# EAGLE design Button Board (EAGLE 7.2.0)
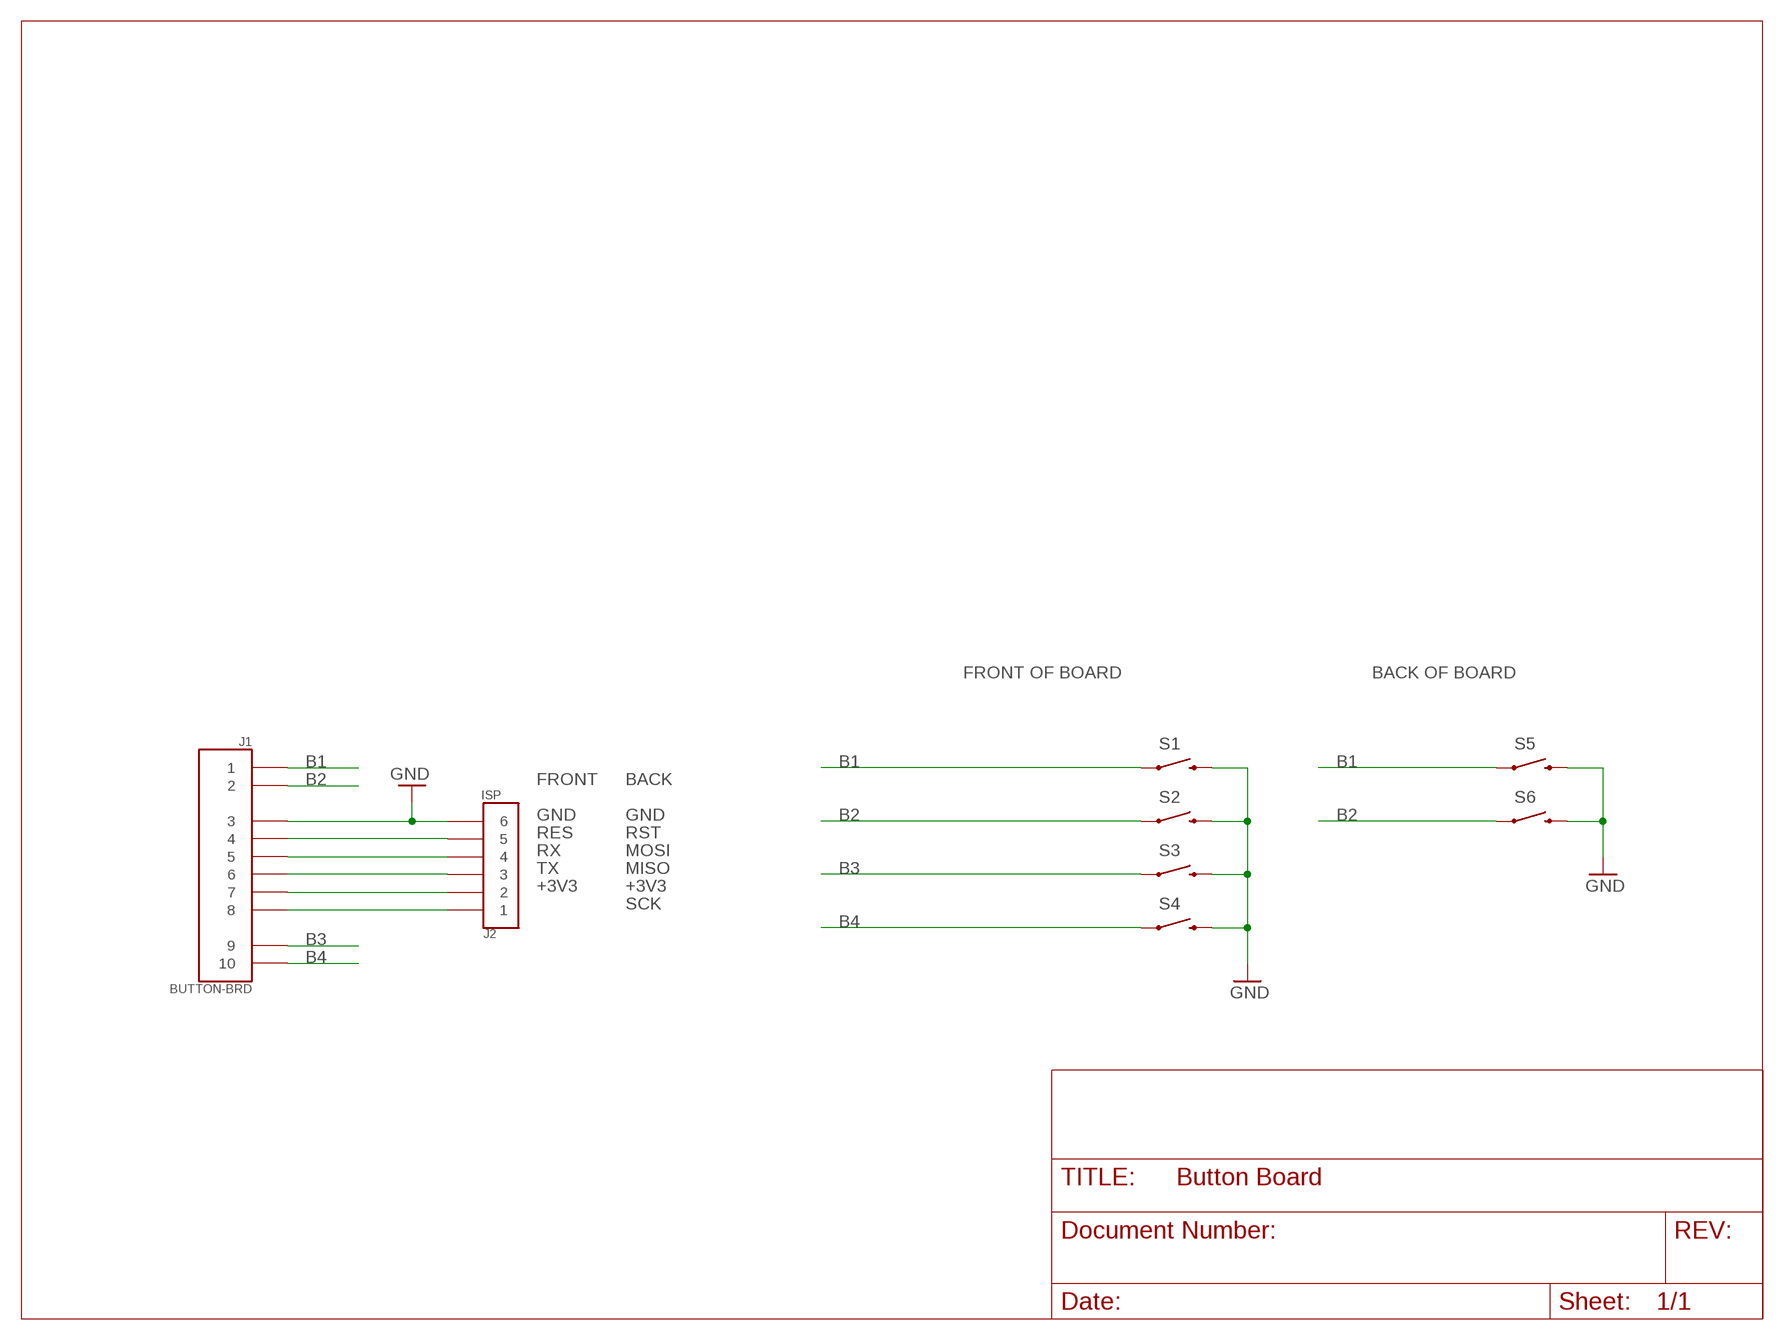
[diagram p0: schematic, sheet 1]

## Parts
J1  BUTTON-BRD  [BUTTON-BRD]
J2  ISP  [ISP]
S1  TACT-SMD  [TACT-SMD]
S2  TACT-SMD  [TACT-SMD]
S3  TACT-SMD  [TACT-SMD]
S4  TACT-SMD  [TACT-SMD]
S5  TACT-SMD  [TACT-SMD]
S6  TACT-SMD  [TACT-SMD]

## Nets
B1: J1.1 S1.P$1 S5.P$1
B2: J1.2 S2.P$1 S6.P$1
B3: J1.9 S3.P$1
B4: J1.10 S4.P$1
GND: J1.3 J2.P$6 S1.P$3 S2.P$3 S3.P$3 S4.P$3 S5.P$3 S6.P$3
N$1: J1.4 J2.P$5
N$2: J1.7 J2.P$2
N$3: J1.5 J2.P$4
N$4: J1.6 J2.P$3
N$6: J1.8 J2.P$1

## Notes on the sheet
- FRONT OF BOARD | BACK OF BOARD
- FRONT | BACK
- GND | GND
- RES | RST
- RX | MOSI
- TX | MISO
- +3V3 | +3V3
- SCK

## Library data of the parts
J1 = OpenWestButtonBoard:BUTTON-BRD
J2 = OpenWestButtonBoard:ISP
S1-S6 = TactSwitch:TACT-SMD: C&K Components PTS645 Series PTS645SM43SMTR92 LFS http://www.digikey.com/product-detail/en/PTS645SM43SMTR92%20LFS/CKN9112TR-ND/1146840

## Board
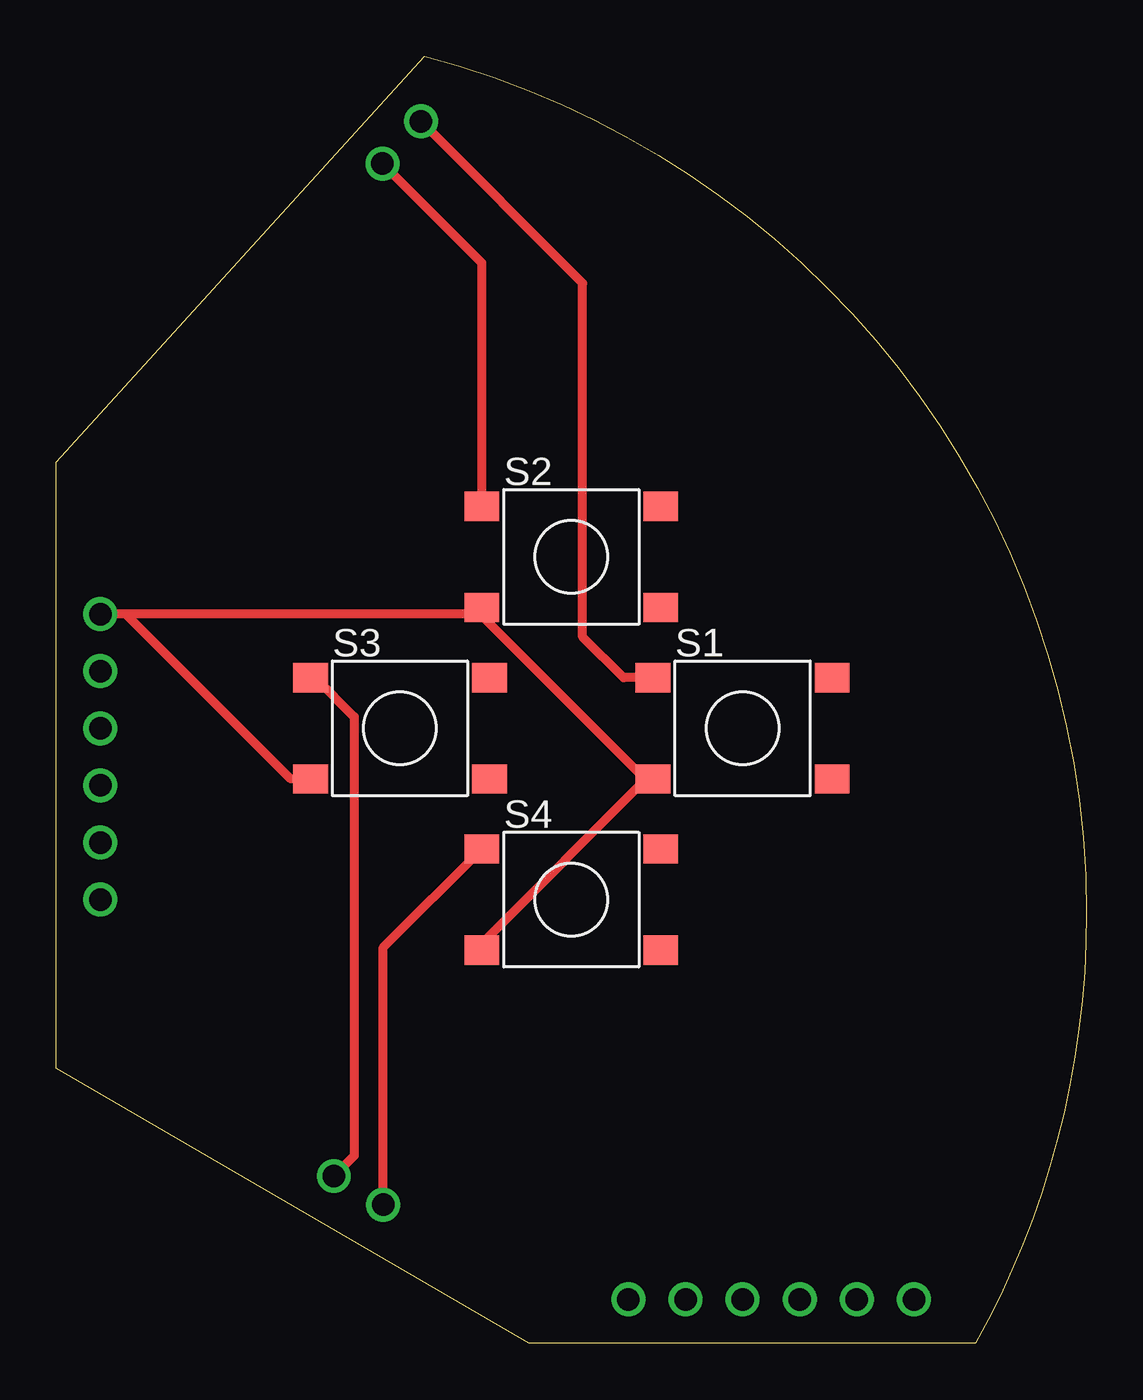
[diagram p1: board, top side]
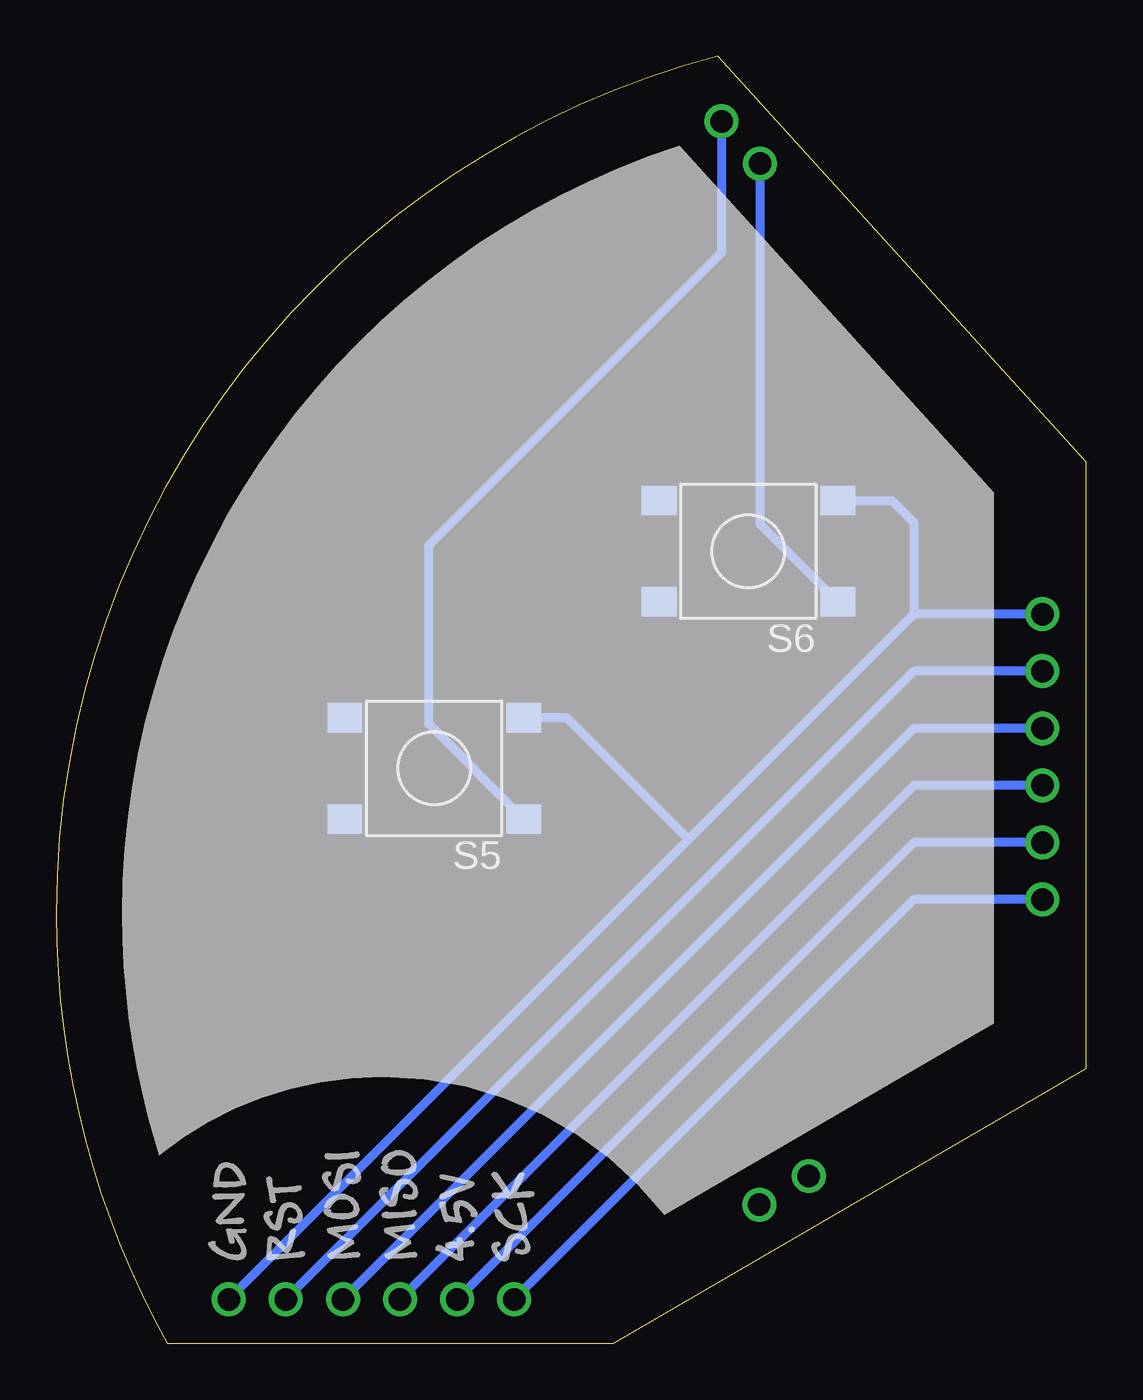
[diagram p2: board, bottom side, seen from below]

Size 45.83 x 57.25 mm. Coordinates in mm from the lower left corner, seen from the top.
Outline: 16.39,57.25 17.96,56.8 19.51,56.29 21.03,55.72 22.52,55.09 23.97,54.4 25.39,53.66 26.78,52.86 28.13,52 29.45,51.09 30.72,50.13 31.95,49.12 33.15,48.07 34.29,46.96 35.4,45.82 36.45,44.62 37.46,43.39 38.42,42.11 39.32,40.8 40.18,39.45 40.98,38.06 41.72,36.64 42.41,35.18 43.04,33.69 43.61,32.17 44.12,30.62 44.56,29.05 44.94,27.45 45.26,25.82 45.5,24.17 45.68,22.5 45.79,20.81 45.83,19.1 45.8,17.81 45.74,16.52 45.64,15.25 45.5,13.99 45.31,12.74 45.09,11.51 44.83,10.28 44.54,9.07 44.21,7.88 43.84,6.7 43.43,5.54 42.99,4.4 42.52,3.27 42.01,2.16 41.47,1.07 40.9,0 21.03,0 0,12.22 0,39.19 16.39,57.25
Copper layers (1*16): Top 0.035mm / dielectric 1.5mm / Bottom 0.035mm
Design rules "default": minimum track width 10mil, minimum drill 24mil, track to track 8mil, track to pad 8mil, pad to pad 8mil, via to via 8mil, smd to smd 8mil, copper to edge 40mil, drill to drill 8mil, minimum pad ring 10mil, minimum via ring 8mil, stop-mask expansion 4mil, vias tented up to drill 0mil, thermal gap 10mil

### Footprints (pad centres in the part's own frame; a part is rotated, then mirrored left to right if it is on the bottom)
BUTTON-BRD = drill 1: 1 -6.686,25.725; 2 -8.396,23.846; 3 -20.955,3.81; 4 -20.955,1.27; 5 -20.955,-1.27; 6 -20.955,-3.81; 7 -20.955,-6.35; 8 -20.955,-8.89; 9 -10.564,-21.188; 10 -8.367,-22.462
ISP = drill 1: P$1 -6.35,0; P$2 -3.81,0; P$3 -1.27,0; P$4 1.27,0; P$5 3.81,0; P$6 6.35,0
TACT-SMD = smd 1.55 x 1.3: P$1 -3.98,2.25; P$2 3.98,2.25; P$3 -3.98,-2.25; P$4 3.98,-2.25

### Placement (x,y rotation side)
J1  22.91,28.62 0 top
J2  31.8,1.95 0 top
S1  30.53,27.35 0 top
S2  22.91,34.97 0 top
S3  15.29,27.35 0 top
S4  22.91,19.73 0 top
S5  29.01,25.58 180 bottom
S6  15.04,35.23 180 bottom

### Tracks (layer width: path | path; a pad name or v marks a point on that pad's centre or on a via)
B1
  Top 0.406: S1.P$1 25.23,29.6 23.42,31.42 23.42,47.15 J1.1
  Bottom 0.406: J1.1 16.23,48.52 29.26,35.48 29.26,27.56 S5.P$1
B2
  Top 0.406: S2.P$1 18.93,48.05 J1.2
  Bottom 0.406: J1.2 14.52,36.44 S6.P$1
B3
  Top 0.406: S3.P$1 11.52,29.6 13.26,27.86 13.26,8.35 J1.9
B4
  Top 0.406: J1.10 14.55,17.6 S4.P$1
GND
  Top 0.406: S4.P$3 18.93,17.79 26.21,25.07 | 26.21,25.07 26.77,25.07 S1.P$3 | S2.P$3 18.93,32.35 | 18.93,32.35 18.85,32.43 3.1,32.43 | 26.21,25.07 18.93,32.35 | 3.1,32.43 J1.3 | S3.P$3 10.43,25.1 3.1,32.43
  Bottom 0.406: J1.3 7.67,32.43 | 7.67,32.43 17.71,22.4 | 17.71,22.4 J2.P$6 | S6.P$3 8.65,37.48 7.67,36.5 7.67,32.43 | S5.P$3 23.13,27.83 17.71,22.4
N$1
  Bottom 0.406: J1.4 7.67,29.89 J2.P$5
N$2
  Bottom 0.406: J1.7 7.67,22.27 J2.P$2
N$3
  Bottom 0.406: J1.5 7.67,27.35 J2.P$4
N$4
  Bottom 0.406: J1.6 7.67,24.81 J2.P$3
N$6
  Bottom 0.406: J1.8 7.67,19.73 J2.P$1